# Altium schematic sheet Top_Level.SchDoc
size A2; SheetNumber: 1; SheetTotal: 25
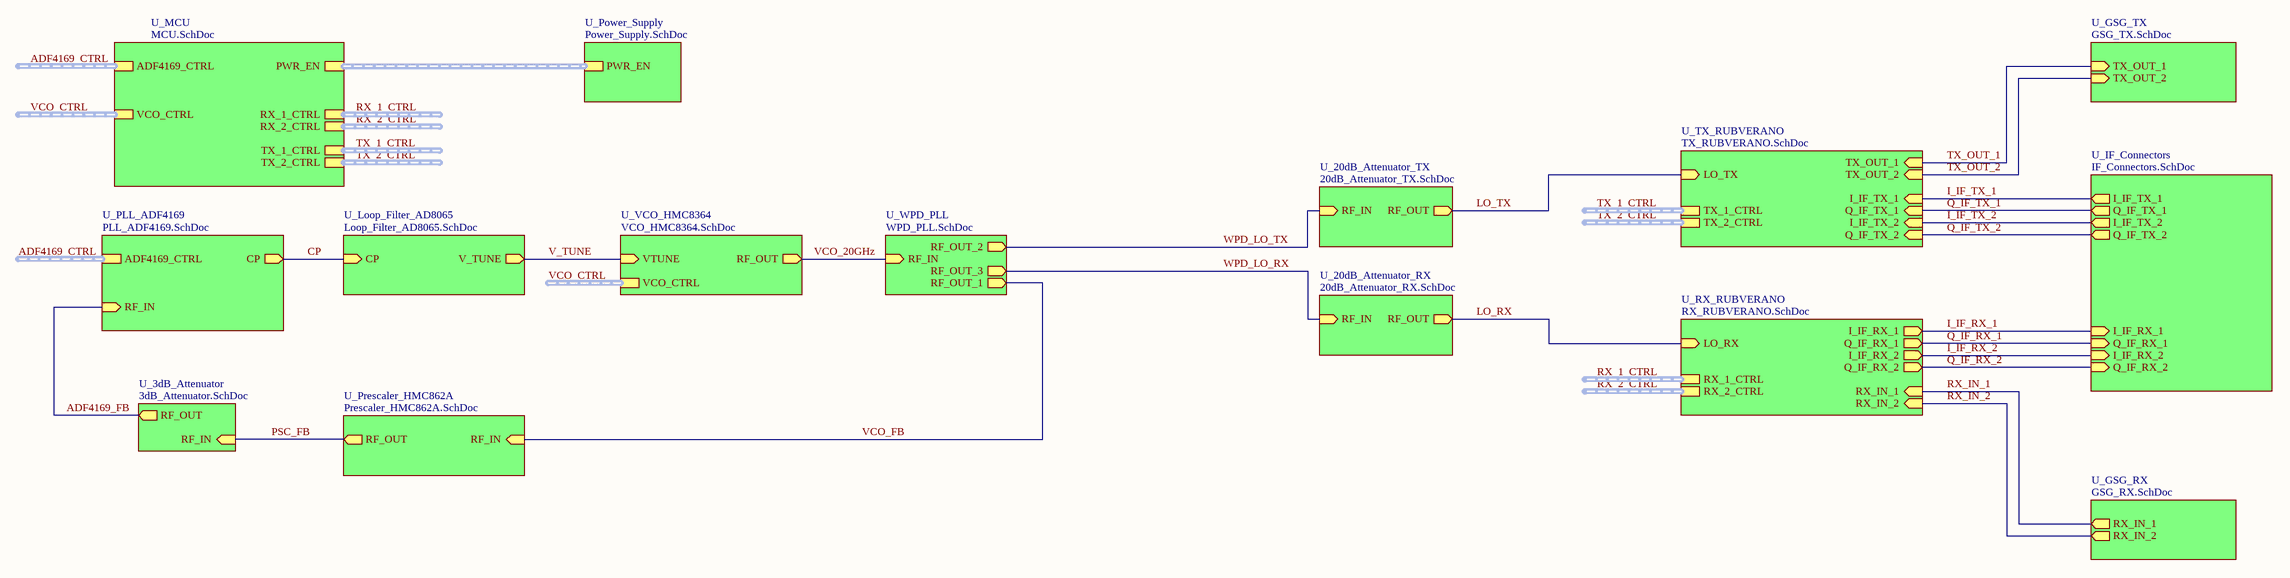
[diagram p0: Top_Level.SchDoc]

## Sub-sheets
U_3dB_Attenuator = 3dB_Attenuator.SchDoc: RF_IN (in), RF_OUT (out)
U_20dB_Attenuator_RX = 20dB_Attenuator_RX.SchDoc: RF_IN (in), RF_OUT (out)
U_20dB_Attenuator_TX = 20dB_Attenuator_TX.SchDoc: RF_IN (in), RF_OUT (out)
U_GSG_RX = GSG_RX.SchDoc: RX_IN_1 (out), RX_IN_2 (out)
U_GSG_TX = GSG_TX.SchDoc: TX_OUT_1 (in), TX_OUT_2 (in)
U_IF_Connectors = IF_Connectors.SchDoc: Q_IF_TX_2 (out), I_IF_TX_2 (out), Q_IF_RX_2 (in), I_IF_RX_2 (in), I_IF_RX_1 (in), Q_IF_RX_1 (in), I_IF_TX_1 (out), Q_IF_TX_1 (out)
U_Loop_Filter_AD8065 = Loop_Filter_AD8065.SchDoc: V_TUNE (out), CP (in)
U_MCU = MCU.SchDoc: PWR_EN (harness PWR_EN), ADF4169_CTRL (harness ADF4169_CTRL), VCO_CTRL (harness VCO_CTRL), RX_1_CTRL (harness RX_1_CTRL), RX_2_CTRL (harness RX_2_CTRL), TX_1_CTRL (harness TX_1_CTRL), TX_2_CTRL (harness TX_2_CTRL)
U_PLL_ADF4169 = PLL_ADF4169.SchDoc: ADF4169_CTRL (harness ADF4169_CTRL), CP (out), RF_IN (in)
U_Power_Supply = Power_Supply.SchDoc: PWR_EN (harness PWR_EN)
U_Prescaler_HMC862A = Prescaler_HMC862A.SchDoc: RF_IN (in), RF_OUT (out)
U_RX_RUBVERANO = RX_RUBVERANO.SchDoc: I_IF_RX_1 (out), I_IF_RX_2 (out), Q_IF_RX_1 (out), Q_IF_RX_2 (out), RX_IN_1 (in), RX_IN_2 (in), RX_2_CTRL (harness RX_2_CTRL), RX_1_CTRL (harness RX_1_CTRL), LO_RX (in)
U_TX_RUBVERANO = TX_RUBVERANO.SchDoc: I_IF_TX_1 (in), I_IF_TX_2 (in), Q_IF_TX_2 (in), Q_IF_TX_1 (in), TX_OUT_1 (in), TX_OUT_2 (in), TX_2_CTRL (harness TX_2_CTRL), TX_1_CTRL (harness TX_1_CTRL), LO_TX (in)
U_VCO_HMC8364 = VCO_HMC8364.SchDoc: VTUNE (in), VCO_CTRL (harness VCO_CTRL), RF_OUT (out)
U_WPD_PLL = WPD_PLL.SchDoc: RF_IN (in), RF_OUT_1 (out), RF_OUT_2 (out), RF_OUT_3 (out)

## Nets
ADF4169_FB: sheet U_PLL_ADF4169/RF_IN, sheet U_3dB_Attenuator/RF_OUT
CP: sheet U_PLL_ADF4169/CP, sheet U_Loop_Filter_AD8065/CP
I_IF_RX_1: sheet U_RX_RUBVERANO/I_IF_RX_1, sheet U_IF_Connectors/I_IF_RX_1
I_IF_RX_2: sheet U_RX_RUBVERANO/I_IF_RX_2, sheet U_IF_Connectors/I_IF_RX_2
I_IF_TX_1: sheet U_TX_RUBVERANO/I_IF_TX_1, sheet U_IF_Connectors/I_IF_TX_1
I_IF_TX_2: sheet U_TX_RUBVERANO/I_IF_TX_2, sheet U_IF_Connectors/I_IF_TX_2
LO_RX: sheet U_RX_RUBVERANO/LO_RX, sheet U_20dB_Attenuator_RX/RF_OUT
LO_TX: sheet U_TX_RUBVERANO/LO_TX, sheet U_20dB_Attenuator_TX/RF_OUT
PSC_FB: sheet U_Prescaler_HMC862A/RF_OUT, sheet U_3dB_Attenuator/RF_IN
Q_IF_RX_1: sheet U_RX_RUBVERANO/Q_IF_RX_1, sheet U_IF_Connectors/Q_IF_RX_1
Q_IF_RX_2: sheet U_RX_RUBVERANO/Q_IF_RX_2, sheet U_IF_Connectors/Q_IF_RX_2
Q_IF_TX_1: sheet U_TX_RUBVERANO/Q_IF_TX_1, sheet U_IF_Connectors/Q_IF_TX_1
Q_IF_TX_2: sheet U_TX_RUBVERANO/Q_IF_TX_2, sheet U_IF_Connectors/Q_IF_TX_2
RX_IN_1: sheet U_RX_RUBVERANO/RX_IN_1, sheet U_GSG_RX/RX_IN_1
RX_IN_2: sheet U_RX_RUBVERANO/RX_IN_2, sheet U_GSG_RX/RX_IN_2
TX_OUT_1: sheet U_TX_RUBVERANO/TX_OUT_1, sheet U_GSG_TX/TX_OUT_1
TX_OUT_2: sheet U_TX_RUBVERANO/TX_OUT_2, sheet U_GSG_TX/TX_OUT_2
V_TUNE: sheet U_Loop_Filter_AD8065/V_TUNE, sheet U_VCO_HMC8364/VTUNE
VCO_20GHz: sheet U_VCO_HMC8364/RF_OUT, sheet U_WPD_PLL/RF_IN
VCO_FB: sheet U_Prescaler_HMC862A/RF_IN, sheet U_WPD_PLL/RF_OUT_1
WPD_LO_RX: sheet U_WPD_PLL/RF_OUT_3, sheet U_20dB_Attenuator_RX/RF_IN
WPD_LO_TX: sheet U_WPD_PLL/RF_OUT_2, sheet U_20dB_Attenuator_TX/RF_IN

## Buses and harness runs
harness ADF4169_CTRL = sheet U_MCU/ADF4169_CTRL
harness ADF4169_CTRL = sheet U_PLL_ADF4169/ADF4169_CTRL
harness RX_1_CTRL = sheet U_MCU/RX_1_CTRL
harness RX_1_CTRL = sheet U_RX_RUBVERANO/RX_1_CTRL
harness RX_2_CTRL = sheet U_MCU/RX_2_CTRL
harness RX_2_CTRL = sheet U_RX_RUBVERANO/RX_2_CTRL
harness sheet U_MCU/PWR_EN = sheet U_Power_Supply/PWR_EN
harness TX_1_CTRL = sheet U_MCU/TX_1_CTRL
harness TX_1_CTRL = sheet U_TX_RUBVERANO/TX_1_CTRL
harness TX_2_CTRL = sheet U_MCU/TX_2_CTRL
harness TX_2_CTRL = sheet U_TX_RUBVERANO/TX_2_CTRL
harness VCO_CTRL = sheet U_MCU/VCO_CTRL
harness VCO_CTRL = sheet U_VCO_HMC8364/VCO_CTRL